# EAGLE schematic dashboard (EAGLE 6.3)
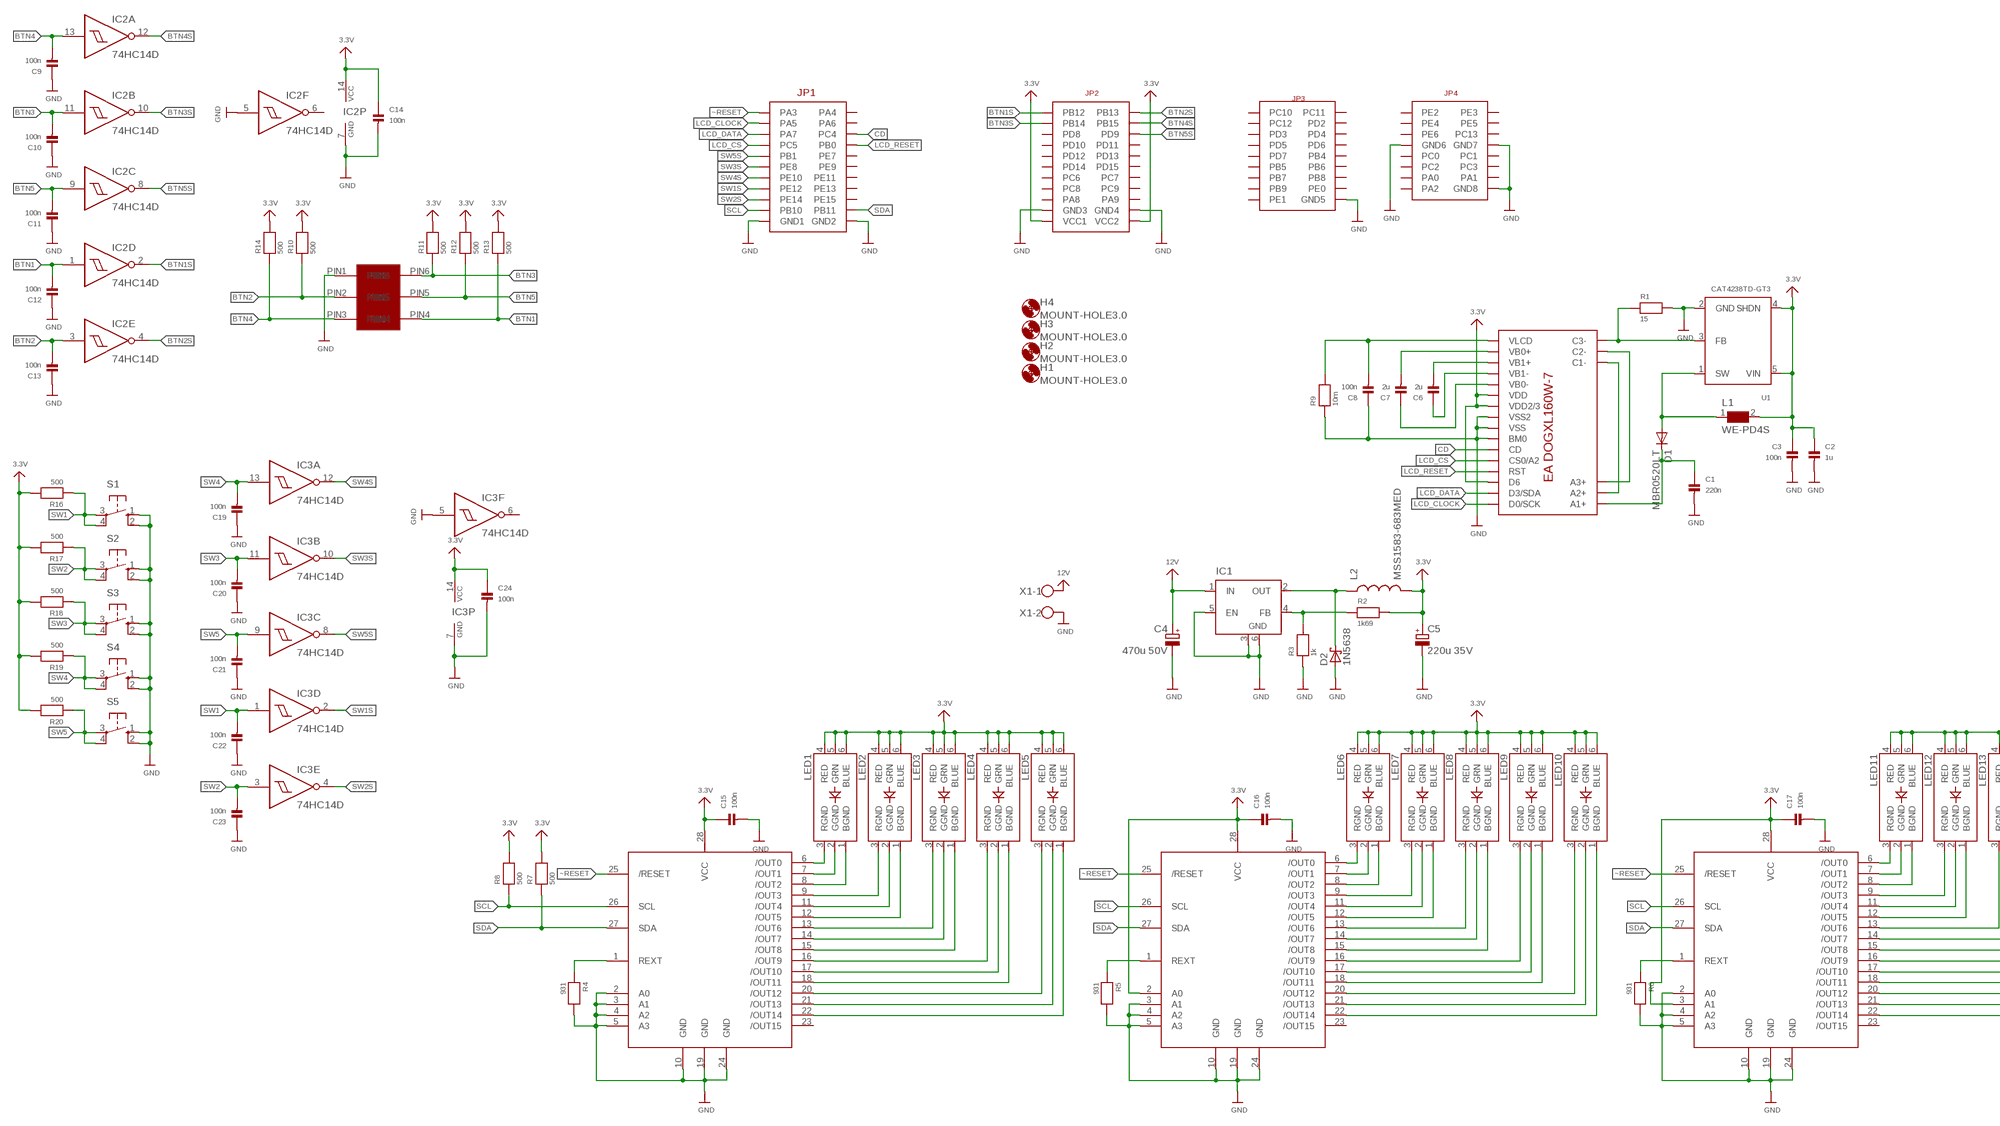
[diagram p0: schematic, sheet 1, part 1 of 2]
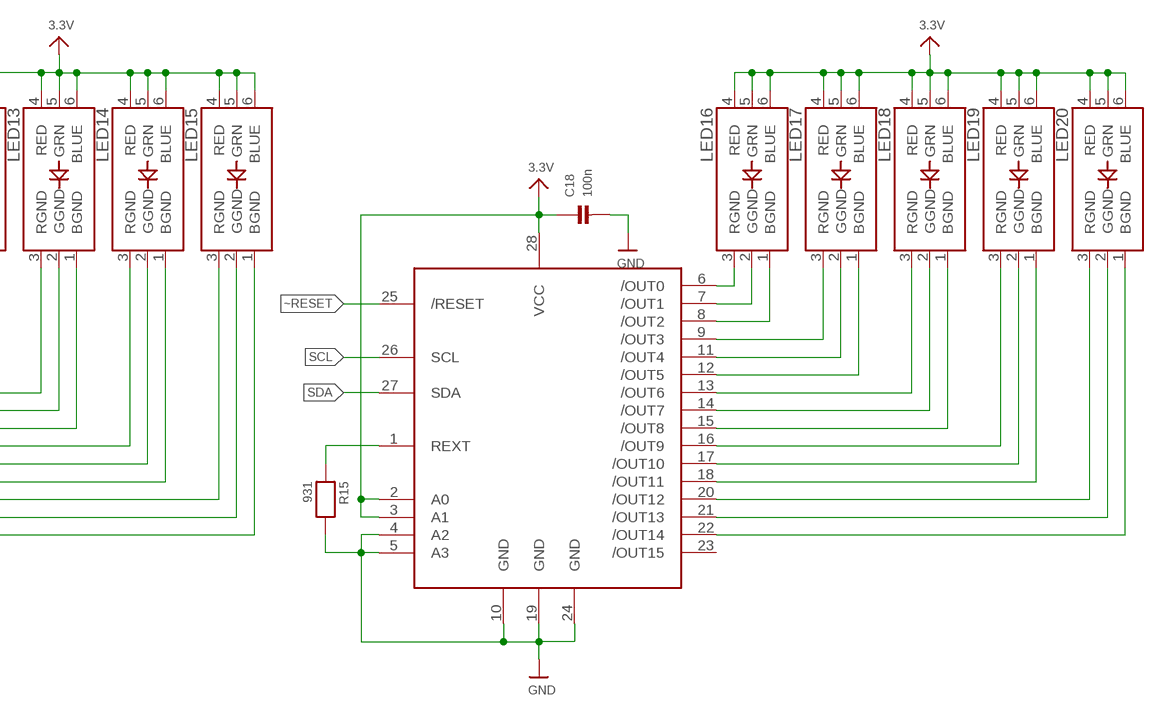
[diagram p1: schematic, sheet 1, part 2 of 2]

## Parts
C1  220n  CAP_CERAMIC_0805  [_0805]
C2  1u  CAP_CERAMIC_0805  [_0805]
C3  100n  CAP_CERAMIC_0603  [_0603]
C4  470u 50V  CPOL-EUE5-13  [E5-13]
C5  220u 35V  CPOL-EUE3.5-8  [E3,5-8]
C6  2u  CAP_CERAMIC_0805  [_0805]
C7  2u  CAP_CERAMIC_0805  [_0805]
C8  100n  CAP_CERAMIC_0603  [_0603]
C9  100n  CAP_CERAMIC_0603  [_0603]
C10  100n  CAP_CERAMIC_0603  [_0603]
C11  100n  CAP_CERAMIC_0603  [_0603]
C12  100n  CAP_CERAMIC_0603  [_0603]
C13  100n  CAP_CERAMIC_0603  [_0603]
C14  100n  CAP_CERAMIC_0603  [_0603]
C15  100n  CAP_CERAMIC_0603  [_0603]
C16  100n  CAP_CERAMIC_0603  [_0603]
C17  100n  CAP_CERAMIC_0603  [_0603]
C18  100n  CAP_CERAMIC_0603  [_0603]
C19  100n  CAP_CERAMIC_0603  [_0603]
C20  100n  CAP_CERAMIC_0603  [_0603]
C21  100n  CAP_CERAMIC_0603  [_0603]
C22  100n  CAP_CERAMIC_0603  [_0603]
C23  100n  CAP_CERAMIC_0603  [_0603]
C24  100n  CAP_CERAMIC_0603  [_0603]
D1  MBR0520LT  [SOD123]
D2  1N5638  [DO13M]
H1  MOUNT-HOLE3.0  [3,0]
H2  MOUNT-HOLE3.0  [3,0]
H3  MOUNT-HOLE3.0  [3,0]
H4  MOUNT-HOLE3.0  [3,0]
IC1  LM2596S  [TO263-5]
IC2  74HC14D  [SO14]
IC3  74HC14D  [SO14]
L1  WE-PD4S  WE-PD4-7445501_S  [S]
L2  MSS1583-683MED  INDUCTORPWR  [CDRH125]
LED1  LED_RGB_PLCC6CREE-CLV6A  [RGBLED_PLCC6]
LED2  LED_RGB_PLCC6CREE-CLV6A  [RGBLED_PLCC6]
LED3  LED_RGB_PLCC6CREE-CLV6A  [RGBLED_PLCC6]
LED4  LED_RGB_PLCC6CREE-CLV6A  [RGBLED_PLCC6]
LED5  LED_RGB_PLCC6CREE-CLV6A  [RGBLED_PLCC6]
LED6  LED_RGB_PLCC6CREE-CLV6A  [RGBLED_PLCC6]
LED7  LED_RGB_PLCC6CREE-CLV6A  [RGBLED_PLCC6]
LED8  LED_RGB_PLCC6CREE-CLV6A  [RGBLED_PLCC6]
LED9  LED_RGB_PLCC6CREE-CLV6A  [RGBLED_PLCC6]
LED10  LED_RGB_PLCC6CREE-CLV6A  [RGBLED_PLCC6]
LED11  LED_RGB_PLCC6CREE-CLV6A  [RGBLED_PLCC6]
LED12  LED_RGB_PLCC6CREE-CLV6A  [RGBLED_PLCC6]
LED13  LED_RGB_PLCC6CREE-CLV6A  [RGBLED_PLCC6]
LED14  LED_RGB_PLCC6CREE-CLV6A  [RGBLED_PLCC6]
LED15  LED_RGB_PLCC6CREE-CLV6A  [RGBLED_PLCC6]
LED16  LED_RGB_PLCC6CREE-CLV6A  [RGBLED_PLCC6]
LED17  LED_RGB_PLCC6CREE-CLV6A  [RGBLED_PLCC6]
LED18  LED_RGB_PLCC6CREE-CLV6A  [RGBLED_PLCC6]
LED19  LED_RGB_PLCC6CREE-CLV6A  [RGBLED_PLCC6]
LED20  LED_RGB_PLCC6CREE-CLV6A  [RGBLED_PLCC6]
R1  15  RESISTOR_0603  [_0603]
R2  1k69  RESISTOR_0603  [_0603]
R3  1k  RESISTOR_0603  [_0603]
R4  931  RESISTOR_0603  [_0603]
R5  931  RESISTOR_0603  [_0603]
R6  931  RESISTOR_0603  [_0603]
R7  500  RESISTOR_0603  [_0603]
R8  500  RESISTOR_0603  [_0603]
R9  10m  RESISTOR_0805  [_0805]
R10  500  RESISTOR_0603  [_0603]
R11  500  RESISTOR_0603  [_0603]
R12  500  RESISTOR_0603  [_0603]
R13  500  RESISTOR_0603  [_0603]
R14  500  RESISTOR_0603  [_0603]
R15  931  RESISTOR_0603  [_0603]
R16  500  RESISTOR_0603  [_0603]
R17  500  RESISTOR_0603  [_0603]
R18  500  RESISTOR_0603  [_0603]
R19  500  RESISTOR_0603  [_0603]
R20  500  RESISTOR_0603  [_0603]
S1  10-XX  [B3F-10XX]
S2  10-XX  [B3F-10XX]
S3  10-XX  [B3F-10XX]
S4  10-XX  [B3F-10XX]
S5  10-XX  [B3F-10XX]
U1  CAT4238TD-GT3  FAN5331  [SOT23-5]
U$1  CPU-BOARD  [CPU-BOARD-JP1]
U$10  EA-DOGXL160W-7  [EA-DOGXL160W-7]
U$30  TLC59116  [TSSOP28]
U$33  TLC59116  [TSSOP28]
U$36  TLC59116  [TSSOP28]
U$42  MICROFIT6  [MICROFIT6SOCK]
U$51  TLC59116  [TSSOP28]
X1  W237-102  [W237-102]

## Nets
3.3V: C2.1 C3.1 C5.+ C14.1 C15.1 C16.1 C17.1 C18.1 C24.1 IC2.14(P:VCC) IC3.14(P:VCC) L1.2 L2.2 LED1.4(RED) LED1.5(GRN) LED1.6(BLUE) LED2.4(RED) LED2.5(GRN) LED2.6(BLUE) LED3.4(RED) LED3.5(GRN) LED3.6(BLUE) LED4.4(RED) LED4.5(GRN) LED4.6(BLUE) LED5.4(RED) LED5.5(GRN) LED5.6(BLUE) LED6.4(RED) LED6.5(GRN) LED6.6(BLUE) LED7.4(RED) LED7.5(GRN) LED7.6(BLUE) LED8.4(RED) LED8.5(GRN) LED8.6(BLUE) LED9.4(RED) LED9.5(GRN) LED9.6(BLUE) LED10.4(RED) LED10.5(GRN) LED10.6(BLUE) LED11.4(RED) LED11.5(GRN) LED11.6(BLUE) LED12.4(RED) LED12.5(GRN) LED12.6(BLUE) LED13.4(RED) LED13.5(GRN) LED13.6(BLUE) LED14.4(RED) LED14.5(GRN) LED14.6(BLUE) LED15.4(RED) LED15.5(GRN) LED15.6(BLUE) LED16.4(RED) LED16.5(GRN) LED16.6(BLUE) LED17.4(RED) LED17.5(GRN) LED17.6(BLUE) LED18.4(RED) LED18.5(GRN) LED18.6(BLUE) LED19.4(RED) LED19.5(GRN) LED19.6(BLUE) LED20.4(RED) LED20.5(GRN) LED20.6(BLUE) R2.2 R7.2 R8.2 R10.2 R11.2 R12.2 R13.2 R14.2 R16.2 R17.2 R18.2 R19.2 R20.2 U1.4(SHDN) U1.5(VIN) U$1.P$43(VCC1) U$1.P$44(VCC2) U$10.P$22(VDD) U$10.P$23(VDD2/3) U$10.P$30(D6) U$30.28(VCC) U$33.2(A0) U$33.28(VCC) U$36.3(A1) U$36.28(VCC) U$51.2(A0) U$51.3(A1) U$51.28(VCC)
12V: C4.+ IC1.1(IN) X1.1
BTN1: C12.2 IC2.1(D:I) R13.1 U$42.PIN4
BTN1S: IC2.2(D:O) U$1.P$23(PB12)
BTN2: C13.2 IC2.3(E:I) R10.1 U$42.PIN2
BTN2S: IC2.4(E:O) U$1.P$24(PB13)
BTN3: C10.2 IC2.11(B:I) R11.1 U$42.PIN6
BTN3S: IC2.10(B:O) U$1.P$25(PB14)
BTN4: C9.2 IC2.13(A:I) R14.1 U$42.PIN3
BTN4S: IC2.12(A:O) U$1.P$26(PB15)
BTN5: C11.2 IC2.9(C:I) R12.1 U$42.PIN5
BTN5S: IC2.8(C:O) U$1.P$28(PD9)
CD: U$1.P$6(PC4) U$10.P$27(CD)
GND: C1.2 C2.2 C3.2 C4.- C5.- C8.1 C9.1 C10.1 C11.1 C12.1 C13.1 C14.2 C15.2 C16.2 C17.2 C18.2 C19.1 C20.1 C21.1 C22.1 C23.1 C24.2 D2.A IC1.3(GND) IC1.5(EN) IC1.6(GND) IC2.5(F:I) IC2.7(P:GND) IC3.5(F:I) IC3.7(P:GND) R1.2 R3.1 R4.2 R5.2 R6.2 R9.1 R15.2 S1.1(S) S1.2(S1) S2.1(S) S2.2(S1) S3.1(S) S3.2(S1) S4.1(S) S4.2(S1) S5.1(S) S5.2(S1) U1.2(GND) U$1.P$21(GND1) U$1.P$22(GND2) U$1.P$41(GND3) U$1.P$42(GND4) U$1.P$62(GND5) U$1.P$69(GND6) U$1.P$70(GND7) U$1.P$78(GND8) U$10.P$24(VSS2) U$10.P$25(VSS) U$10.P$26(BM0) U$30.2(A0) U$30.3(A1) U$30.4(A2) U$30.5(A3) U$30.10(GND) U$30.19(GND) U$30.24(GND) U$33.3(A1) U$33.4(A2) U$33.5(A3) U$33.10(GND) U$33.19(GND) U$33.24(GND) U$36.2(A0) U$36.4(A2) U$36.5(A3) U$36.10(GND) U$36.19(GND) U$36.24(GND) U$42.PIN1 U$51.4(A2) U$51.5(A3) U$51.10(GND) U$51.19(GND) U$51.24(GND) X1.2
LCD_CLOCK: U$1.P$3(PA5) U$10.P$32(D0/SCK)
LCD_CS: U$1.P$7(PC5) U$10.P$28(CS0/A2)
LCD_DATA: U$1.P$5(PA7) U$10.P$31(D3/SDA)
LCD_RESET: U$1.P$8(PB0) U$10.P$29(RST)
N$1: U$10.P$2(A2+) U$10.P$14(C1-)
N$2: U$10.P$3(A3+) U$10.P$15(C2-)
N$3: R1.1 U1.3(FB) U$10.P$16(C3-)
N$4: C1.1 D1.C U$10.P$1(A1+)
N$5: D1.A L1.1 U1.1(SW)
N$6: IC1.4(FB) R2.1 R3.2
N$7: LED1.3(RGND) U$30.6(/OUT0)
N$8: LED1.2(GGND) U$30.7(/OUT1)
N$9: D2.C IC1.2(OUT) L2.1
N$10: LED1.1(BGND) U$30.8(/OUT2)
N$11: LED2.3(RGND) U$30.9(/OUT3)
N$12: LED2.2(GGND) U$30.11(/OUT4)
N$13: LED2.1(BGND) U$30.12(/OUT5)
N$14: LED3.3(RGND) U$30.13(/OUT6)
N$15: LED3.2(GGND) U$30.14(/OUT7)
N$16: LED3.1(BGND) U$30.15(/OUT8)
N$17: LED4.3(RGND) U$30.16(/OUT9)
N$18: LED4.2(GGND) U$30.17(/OUT10)
N$19: LED4.1(BGND) U$30.18(/OUT11)
N$20: LED5.3(RGND) U$30.20(/OUT12)
N$21: LED5.2(GGND) U$30.21(/OUT13)
N$22: LED5.1(BGND) U$30.22(/OUT14)
N$23: LED6.3(RGND) U$33.6(/OUT0)
N$24: LED6.2(GGND) U$33.7(/OUT1)
N$25: LED6.1(BGND) U$33.8(/OUT2)
N$26: LED7.3(RGND) U$33.9(/OUT3)
N$27: LED7.2(GGND) U$33.11(/OUT4)
N$28: LED7.1(BGND) U$33.12(/OUT5)
N$29: LED8.3(RGND) U$33.13(/OUT6)
N$30: LED8.2(GGND) U$33.14(/OUT7)
N$31: LED8.1(BGND) U$33.15(/OUT8)
N$32: LED9.3(RGND) U$33.16(/OUT9)
N$33: LED9.2(GGND) U$33.17(/OUT10)
N$34: LED9.1(BGND) U$33.18(/OUT11)
N$35: LED10.3(RGND) U$33.20(/OUT12)
N$36: LED10.2(GGND) U$33.21(/OUT13)
N$37: LED10.1(BGND) U$33.22(/OUT14)
N$38: LED11.3(RGND) U$36.6(/OUT0)
N$39: LED11.2(GGND) U$36.7(/OUT1)
N$40: LED11.1(BGND) U$36.8(/OUT2)
N$41: LED12.3(RGND) U$36.9(/OUT3)
N$42: LED12.2(GGND) U$36.11(/OUT4)
N$43: LED12.1(BGND) U$36.12(/OUT5)
N$44: LED13.3(RGND) U$36.13(/OUT6)
N$45: LED13.2(GGND) U$36.14(/OUT7)
N$46: LED13.1(BGND) U$36.15(/OUT8)
N$47: LED14.3(RGND) U$36.16(/OUT9)
N$48: LED14.2(GGND) U$36.17(/OUT10)
N$49: LED14.1(BGND) U$36.18(/OUT11)
N$50: LED15.3(RGND) U$36.20(/OUT12)
N$51: LED15.2(GGND) U$36.21(/OUT13)
N$52: LED15.1(BGND) U$36.22(/OUT14)
N$53: R4.1 U$30.1(REXT)
N$54: LED16.3(RGND) U$51.6(/OUT0)
N$55: R5.1 U$33.1(REXT)
N$56: R6.1 U$36.1(REXT)
N$57: C6.1 U$10.P$20(VB1-)
N$58: C7.1 U$10.P$21(VB0-)
N$59: C6.2 U$10.P$19(VB1+)
N$60: C7.2 U$10.P$18(VB0+)
N$61: C8.2 R9.2 U$10.P$17(VLCD)
N$62: LED16.2(GGND) U$51.7(/OUT1)
N$63: LED16.1(BGND) U$51.8(/OUT2)
N$64: LED17.3(RGND) U$51.9(/OUT3)
N$65: LED17.2(GGND) U$51.11(/OUT4)
N$66: LED17.1(BGND) U$51.12(/OUT5)
N$67: LED18.3(RGND) U$51.13(/OUT6)
N$68: LED18.2(GGND) U$51.14(/OUT7)
N$69: LED18.1(BGND) U$51.15(/OUT8)
N$70: LED19.3(RGND) U$51.16(/OUT9)
N$71: LED19.2(GGND) U$51.17(/OUT10)
N$72: LED19.1(BGND) U$51.18(/OUT11)
N$73: LED20.3(RGND) U$51.20(/OUT12)
N$74: LED20.2(GGND) U$51.21(/OUT13)
N$75: LED20.1(BGND) U$51.22(/OUT14)
N$76: R15.1 U$51.1(REXT)
SCL: R8.1 U$1.P$19(PB10) U$30.26(SCL) U$33.26(SCL) U$36.26(SCL) U$51.26(SCL)
SDA: R7.1 U$1.P$20(PB11) U$30.27(SDA) U$33.27(SDA) U$36.27(SDA) U$51.27(SDA)
SW1: C22.2 IC3.1(D:I) R16.1 S1.3(P) S1.4(P1)
SW1S: IC3.2(D:O) U$1.P$15(PE12)
SW2: C23.2 IC3.3(E:I) R17.1 S2.3(P) S2.4(P1)
SW2S: IC3.4(E:O) U$1.P$17(PE14)
SW3: C20.2 IC3.11(B:I) R18.1 S3.3(P) S3.4(P1)
SW3S: IC3.10(B:O) U$1.P$11(PE8)
SW4: C19.2 IC3.13(A:I) R19.1 S4.3(P) S4.4(P1)
SW4S: IC3.12(A:O) U$1.P$13(PE10)
SW5: C21.2 IC3.9(C:I) R20.1 S5.3(P) S5.4(P1)
SW5S: IC3.8(C:O) U$1.P$9(PB1)
~RESET: U$1.P$1(PA3) U$30.25(/RESET) U$33.25(/RESET) U$36.25(/RESET) U$51.25(/RESET)
Unconnected: IC2.6(F:O) IC3.6(F:O) U$1.P$2(PA4) U$1.P$4(PA6) U$1.P$10(PE7) U$1.P$12(PE9) U$1.P$14(PE11) U$1.P$16(PE13) U$1.P$18(PE15) U$1.P$27(PD8) U$1.P$29(PD10) U$1.P$30(PD11) U$1.P$31(PD12) U$1.P$32(PD13) U$1.P$33(PD14) U$1.P$34(PD15) U$1.P$35(PC6) U$1.P$36(PC7) U$1.P$37(PC8) U$1.P$38(PC9) U$1.P$39(PA8) U$1.P$40(PA9) U$1.P$45(PC10) U$1.P$46(PC11) U$1.P$47(PC12) U$1.P$48(PD2) U$1.P$49(PD3) U$1.P$50(PD4) U$1.P$51(PD5) U$1.P$52(PD6) U$1.P$53(PD7) U$1.P$54(PB4) U$1.P$55(PB5) U$1.P$56(PB6) U$1.P$57(PB7) U$1.P$58(PB8) U$1.P$59(PB9) U$1.P$60(PE0) U$1.P$61(PE1) U$1.P$63(PE2) U$1.P$64(PE3) U$1.P$65(PE4) U$1.P$66(PE5) U$1.P$67(PE6) U$1.P$68(PC13) U$1.P$71(PC0) U$1.P$72(PC1) U$1.P$73(PC2) U$1.P$74(PC3) U$1.P$75(PA0) U$1.P$76(PA1) U$1.P$77(PA2) U$30.23(/OUT15) U$33.23(/OUT15) U$36.23(/OUT15) U$51.23(/OUT15)

## Library data of the parts
C1-C3 C6-C24 = microbuilder:CAP_CERAMIC: Ceramic Capacitors 0402 - 0402 Surface Mount Capacitors 16pF 50V 5% [Digikey: 445-4899-2-ND] 18pF 50V 5% [Digikey: 490-1281-2-ND] 22pF 50V 5% [Digikey: 490-1283-2-ND] 68pF 50V 5% [Digikey: 490-1289-2-ND] 0.1uF 10V 10% [Digikey: 490-1318-2-ND] 1.0uF 6.3V 10% [Digikey: 490-1320-2-ND] 0603 - 0603 Surface Mount Capacitors 16 pF 50V 5% [Digikey: 445-5051-2-ND] 22 pF 50V [Digikey: PCC220ACVTR-ND] 33 pF 50V 5% [Digikey: 490-1415-1-ND] 56pF 50V 5% [Digikey: 490-1421-1-ND] 220pF 50V 5% [Digikey: 445-1285-1-ND] 680 pF 50V 2200 pF 50V 5% C0G [Digikey: 445-1297-1-ND] 5600 pF 100V 5% X7R [Digikey: 478-3711-1-ND] 0.1 µF 25V 10% [Digikey: PCC2277TR-ND] 0.22 µF 16V 10% X7R [Digikey: 445-1318-1-ND] 1.0 µF 25V 10% [Digikey: 445-5146-2-ND] 0603 - RF Specific 3pF 250V +/-0.1pF RF [Digikey: 712-1347-1-ND] 18 pF 250V 5% [Digikey: 478-3505-1-ND or 712-1322-1-ND] 56 pF 250V 5% C0G RF [Digikey: 490-4867-1-ND] 68 pF 250V RF [Digikey: 490-4868-1-ND] 0805 - 0805 Surface Mount Capacitors 220 pF 250V 2% RF Ceramic Capacitor [Digikey: 712-1398-1-ND] 1000 pF 50V 2% NP0 Ceramic Capacitor [Digikey: 478-3760-1-ND] 0.1 µF 25V 10% Ceramic Capacitor [Digikey: PCC1828TR-ND] 1.0 µF 16V 10% Ceramic Capacitor[Digikey: 490-1691-2-ND] 10.0 µF 10V 10% Ceramic Capacitor[Digikey: 709-1228-1-ND] 10.0 uF 16V 10% Ceramic Capacitor [Digikey: 478-5165-2-ND] 47 uF 6.3V 20% Ceramic Capacitor [Digikey: 587-1779-1-ND or 399-5506-1-ND] 1206 - 1206 Surface Mount Capacitors 47uF 10V 20% Ceramic Capacitor [Digikey: 490-5528-1-ND or 399-5508-1-ND or 445-6010-1-ND] 100uF 6.3V -20%, +80% Y5V Ceramic Capacitor (Digikey: 490-4512-1-ND, Mouser: 81-GRM31CF50J107ZE1L)
C4 C5 = rcl:CPOL-EU: POLARIZED CAPACITOR, European symbol
D1 = diode:MBR0520LT: SCHOTTKY BARRIER RECTIFIER Source: http://onsemi.com .. MBR0520LT1-D.pdf
D2 = diode:1N5638: DIODE schottky
H1-H4 = holes:MOUNT-HOLE: MOUNTING HOLE with drill center marker
IC1 = linear:LM2596S: STEP-DOWN VOLTAGE REGULATOR
IC2 IC3 = 74xx-eu:74*14: Hex schmitt trigger INVERTER
L1 = WE-PD4:WE-PD4: SMD-Power Inductors WE-PD4 - Current loading up to 35 A - Compact size - Low-loss ferrite core - High storage capacity - Industry standardized size - Application frequency range up to 10 MHz -- Is recommended for the application with switching regulators from National Semiconductor, Linear Technology, Texas Instruments and Fairchild Semiconductor -- Noise suppression -- Perfectly suitable for switching regulators with extremely high efficiency; MPN: 7445501; OC_FARNELL: 1636112; OC_NEWARK: 08P2667; PACKAGE: Type S; SUPPLIER: Wuerth Elektronik
L2 = SparkFun-Passives:INDUCTOR: Inductors Basic Inductor/Choke - 0603 and 1206. Footprints are not proven and vary greatly between part numbers. INDUCTOR POWER 3.3UH 4.0A SMD 0.197" L x 0.197" W x 0.177" H (5.00mm x 5.00mm x 4.50mm)
LED1-LED20 = microbuilder:LED_RGB_PLCC6: RGB LED Cree CLV6A-FKB - Digikey: CLV6A-FKB-CK1P1G1BB7R3R3TR-ND DC Foreward Current: 20mA Foreward Voltage: R = 2.0, G = 3.2, B = 3.2 Viewing Angle: 120°
R1-R20 = microbuilder:RESISTOR: Resistors 0402 - 0402 Surface Mount Package 22 Ohm 1% 1/16W [Digikey: 311-22.0LRTR-ND] 33 Ohm 5% 1/16W 1.0K 5% 1/16W 1.5K 5% 1/16W 2.0K 1% 1/16W 10.0K 1% 1/16W [Digikey: 311-10.0KLRTR-ND] 10.0K 5% 1/16W [Digikey: RMCF0402JT10K0TR-ND] 12.1K 1% 1/16W [Digikey: 311-22.0LRTR-ND] 100.0K 5% 1/16W 0603 - 0603 Surface Mount Package 0 Ohm 1/10 Watt 1% Resistor 15 Ohm 1/10 Watt 1% Resistor 33 Ohm 1/10 Watt 1% Resistor 49.9 Ohm 1/10 Watt 1% Resistor 100 Ohm 1/10 Watt 1% Resistor 150 Ohm 1/10 Watt 1% Resistor 240 Ohm 1/10 Watt 1% Resistor 390 Ohm 1/10 Watt 1% Resistor 560 Ohm 1/10 Watt 1% Resistor 680 Ohm 1/10 Watt 1% Resistor 750 Ohm 1/10 Watt 1% Resistor 1.0K Ohm 1/10 Watt 1% Resistor 1.5K Ohm 1/10 Watt 1% Resistor 2.0K Ohm 1/10 Watt 1% Resistor 2.2K Ohm 1/10 Watt 1% Resistor 3.3K Ohm 1/10 Watt 1% Resistor 4.7K Ohm 1/10 Watt 1% Resistor 10.0K Ohm 1/10 Watt 1% Resistor 12.0K Ohm 1/10 Watt 1% Resistor 12.1K Ohm 1/10 Watt 1% Resistor 20.0K Ohm 1/10 Watt 1% Resistor 33.0K Ohm 1/10 Watt 1% Resistor 100.0K Ohm 1/10 Watt 1% Resistor 0805 - 0805 Surface Mount Package 0 Ohm 1/8 Watt 1% Resistor 33 Ohm 1/8 Watt 1% Resistor 100 Ohm 1/8 Watt 1% Resistor 150 Ohm 1/8 Watt 1% Resistor 200 Ohm 1/8 Watt 1% Resistor 240 Ohm 1/8 Watt 1% Resistor 330 Ohm 1/8 Watt 1% Resistor 390 Ohm 1/8 Watt 1% Resistor 470 Ohm 1/8 Watt 1% Resistor 1.0K Ohm 1/8 Watt 1% Resistor 1.5K Ohm 1/8 Watt 1% Resistor 2.0K Ohm 1/8 Watt 1% Resistor 4.7K Ohm 1/8 Watt 1% Resistor 5.1K Ohm 1/8 Watt 1% Resistor 5.6K Ohm 1/8 Watt 1% Resistor 10.0K Ohm 1/8 Watt 1% Resistor 22.0K Ohm 1/8 Watt 1% Resistor 33.0K Ohm 1/8 Watt 1% Resistor 100K Ohm 1/8 Watt 1% Resistor 1206 - 1206 Surface Mount Package 2012 - 2010 Surface Mount Package 0.11 Ohm 1/2 Watt 1% Resistor - Digikey: RHM.11UCT-ND
S1-S5 = switch-omron:10-XX: OMRON SWITCH; MPN: B3F-1000; OC_FARNELL: 176432; OC_NEWARK: 36M3542
U1 = microbuilder:FAN5331: FAN5331 - LED/OLED 20V Boost Converter Digikey: FAN5331SXCT-ND
U$1 = unicorn_v2:CPU-BOARD
U$10 = unicorn_v2:EA-DOGXL160W-7
U$30 U$33 U$36 U$51 = tlc:TLC59116
U$42 = unicorn:MICROFIT6
X1 = con-wago-500:W237-102: WAGO SCREW CLAMP; MPN: 237-102; OC_FARNELL: unknown; OC_NEWARK: 70K9898